# Altium schematic sheet XVF3000.SchDoc
size A3; SheetNumber: 1; SheetTotal: 7
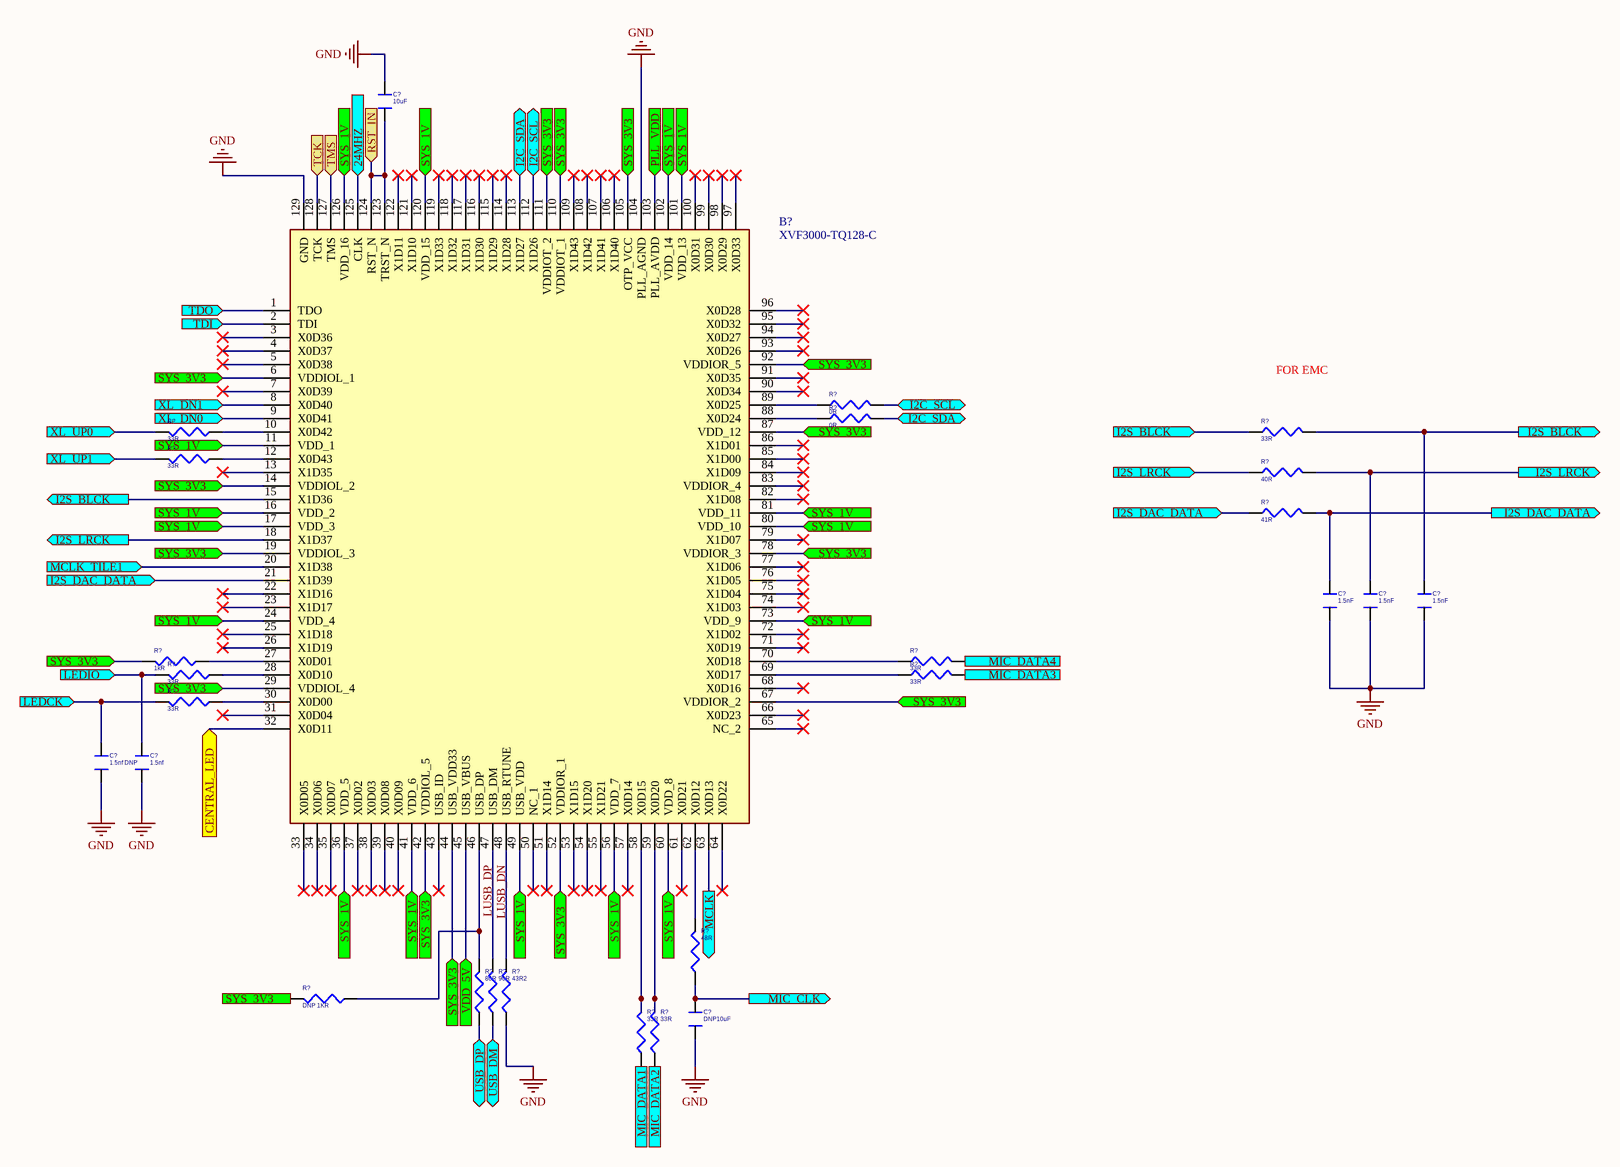
[diagram p0: XVF3000.SchDoc]

## Parts
(Parts that share a designator on the sheet are numbered #1, #2 ... from top to bottom, then left to right.)
B?  XVF3000-TQ128-C  [QFP40P1600X1600X120-129N]
C?#1  10uF  [C0603]
C?#2  1.5nF  [C0603]
C?#3  1.5nF  [C0603]
C?#4  1.5nF  [C0603]
C?#5  1.5nf DNP  [C0603]
C?#6  1.5nf  [C0603]
C?#7  DNP10uF  [C0603]
R?#1  33R  [R 0603]
R?#2  0R  [R 0603]
R?#3  0R  [R 0603]
R?#4  33R  [R 0603]
R?#5  33R  [R 0603]
R?#6  40R  [R 0603]
R?#7  41R  [R 0603]
R?#8  1kR  [R 0603]
R?#9  33R  [R 0603]
R?#10  33R  [R 0603]
R?#11  33R  [R 0603]
R?#12  33R  [R 0603]
R?#13  48R  [R 0603]
R?#14  DNP 1KR  [R 0603]
R?#15  80R  [R 0603]
R?#16  90R  [R 0603]
R?#17  43R2  [R 0603]
R?#18  33R  [R 0603]
R?#19  33R  [R 0603]

## Ports
24MHZ (in), _I2S_BLCK (out), _I2S_DAC_DATA (out), _I2S_LRCK (out), CENTRAL_LED (in), I2C_SCL (bidir), I2C_SDA (bidir), I2S_BLCK (in), I2S_BLCK (out), I2S_DAC_DATA (in), I2S_LRCK (in), I2S_LRCK (out), LEDCK (in), LEDIO (in), MCLK (out), MCLK_TILE1 (in), MIC_CLK (out), MIC_DATA1 (in), MIC_DATA2 (in), MIC_DATA3 (in), MIC_DATA4 (in), PLL_VDD (in), RST_IN (in), SYS_1V (in), SYS_3V3 (in), TCK (in), TDI (in), TDO (in), TMS (in), USB_DM (bidir), USB_DP (bidir), VDD_5V (in), XL_DN0 (in), XL_DN1 (in), XL_UP0 (in), XL_UP1 (in)

## Nets
GND: B?.104(PLL_AGND) B?.129(GND) C?#1.2 C?#2.1 C?#3.1 C?#4.1 C?#5.1 C?#6.1 C?#7.1 R?#17.1
24MHZ: B?.125(CLK) ; port 24MHZ
_I2S_BLCK: C?#4.2 R?#5.2 ; port _I2S_BLCK
_I2S_DAC_DATA: C?#2.2 R?#7.2 ; port _I2S_DAC_DATA
_I2S_LRCK: C?#3.2 R?#6.2 ; port _I2S_LRCK
CENTRAL_LED: B?.32(X0D11) ; port CENTRAL_LED
I2C_SCL: B?.112(X1D26) R?#2.2 ; port I2C_SCL
I2C_SDA: B?.113(X1D27) R?#3.2 ; port I2C_SDA
I2S_BLCK: B?.15(X1D36) R?#5.1 ; port I2S_BLCK
I2S_DAC_DATA: B?.21(X1D39) R?#7.1 ; port I2S_DAC_DATA
I2S_LRCK: B?.18(X1D37) R?#6.1 ; port I2S_LRCK
LEDCK: C?#5.2 R?#11.2 ; port LEDCK
LEDIO: C?#6.2 R?#9.2 ; port LEDIO
LUSB_DN: B?.47(USB_DM) R?#16.2
LUSB_DP: B?.46(USB_DP) R?#14.1 R?#15.2
MCLK: B?.63(X0D13) ; port MCLK
MCLK_TILE1: B?.20(X1D38) ; port MCLK_TILE1
MIC_CLK: C?#7.2 R?#13.1 ; port MIC_CLK
MIC_DATA1: R?#18.1 ; port MIC_DATA1
MIC_DATA2: R?#19.1 ; port MIC_DATA2
MIC_DATA3: R?#12.2 ; port MIC_DATA3
MIC_DATA4: R?#10.2 ; port MIC_DATA4
PLL_VDD: B?.103(PLL_AVDD) ; port PLL_VDD
RST_IN: B?.123(TRST_N) B?.124(RST_N) C?#1.1 ; port RST_IN
SYS_1V: B?.11(VDD_1) B?.16(VDD_2) B?.17(VDD_3) B?.24(VDD_4) B?.36(VDD_5) B?.41(VDD_6) B?.49(USB_VDD) B?.56(VDD_7) B?.60(VDD_8) B?.73(VDD_9) B?.80(VDD_10) B?.81(VDD_11) B?.101(VDD_13) B?.102(VDD_14) B?.120(VDD_15) B?.126(VDD_16) ; port SYS_1V
SYS_3V3: B?.6(VDDIOL_1) B?.14(VDDIOL_2) B?.19(VDDIOL_3) B?.29(VDDIOL_4) B?.42(VDDIOL_5) B?.44(USB_VDD33) B?.52(VDDIOR_1) B?.67(VDDIOR_2) B?.78(VDDIOR_3) B?.87(VDD_12) B?.92(VDDIOR_5) B?.105(OTP_VCC) B?.110(VDDIOT_1) B?.111(VDDIOT_2) R?#8.2 R?#14.2 ; port SYS_3V3
TCK: B?.128(TCK) ; port TCK
TDI: B?.2(TDI) ; port TDI
TDO: B?.1(TDO) ; port TDO
TMS: B?.127(TMS) ; port TMS
USB_DM: R?#16.1 ; port USB_DM
USB_DP: R?#15.1 ; port USB_DP
VDD_5V: B?.45(USB_VBUS) ; port VDD_5V
XL_DN0: B?.9(X0D41) ; port XL_DN0
XL_DN1: B?.8(X0D40) ; port XL_DN1
XL_UP0: R?#1.2 ; port XL_UP0
XL_UP1: R?#4.2 ; port XL_UP1
NetB?_10: B?.10(X0D42) R?#1.1
NetB?_12: B?.12(X0D43) R?#4.1
NetB?_27: B?.27(X0D01) R?#8.1
NetB?_28: B?.28(X0D10) R?#9.1
NetB?_30: B?.30(X0D00) R?#11.1
NetB?_48: B?.48(USB_RTUNE) R?#17.2
NetB?_58: B?.58(X0D15) R?#18.2
NetB?_59: B?.59(X0D20) R?#19.2
NetB?_62: B?.62(X0D12) R?#13.2
NetB?_69: B?.69(X0D17) R?#12.1
NetB?_70: B?.70(X0D18) R?#10.1
NetB?_88: B?.88(X0D24) R?#3.1
NetB?_89: B?.89(X0D25) R?#2.1

Not connected (* = marked no-connect by the designer): B? 3(X0D36)* 4(X0D37)* 5(X0D38)* 7(X0D39)* 13(X1D35)* 22(X1D16)* 23(X1D17)* 25(X1D18)* 26(X1D19)* 31(X0D04)* 33(X0D05)* 34(X0D06)* 35(X0D07)* 37(X0D02)* 38(X0D03)* 39(X0D08)* 40(X0D09)* 43(USB_ID)* 50(NC_1)* 51(X1D14)* 53(X1D15)* 54(X1D20)* 55(X1D21)* 57(X0D14)* 61(X0D21)* 64(X0D22)* 65(NC_2)* 66(X0D23)* 68(X0D16)* 71(X0D19)* 72(X1D02)* 74(X1D03)* 75(X1D04)* 76(X1D05)* 77(X1D06)* 79(X1D07)* 82(X1D08)* 83(VDDIOR_4)* 84(X1D09)* 85(X1D00)* 86(X1D01)* 90(X0D34)* 91(X0D35)* 93(X0D26)* 94(X0D27)* 95(X0D32)* 96(X0D28)* 97(X0D33)* 98(X0D29)* 99(X0D30)* 100(X0D31)* 106(X1D40)* 107(X1D41)* 108(X1D42)* 109(X1D43)* 114(X1D28)* 115(X1D29)* 116(X1D30)* 117(X1D31)* 118(X1D32)* 119(X1D33)* 121(X1D10)* 122(X1D11)*

## Notes on the sheet
- FOR EMC

## Library data of the parts
B? = XVF3000-TQ128-C: IC PROC 32BIT VOICE XCORE TQ128; Manufacturer_Name: XMOS; Geometry.Height: 1.2mm; Manufacturer_Part_Number: XVF3000-TQ128-C; Mouser Part Number: *; Mouser Price/Stock: *; Arrow Part Number: *; Arrow Price/Stock: *; Datasheet Link: https://datasheet.datasheetarchive.com/originals/distributors/DKDS-37/730530.pdf
C?#1-C?#7 = CAPACITOR_0_Dup5_3: CAP ±20%/10V/X5R/SMT0603; PAGE: 2
R?#1-R?#19 = R_Dup1: RES 1/16W 5% SMT0402